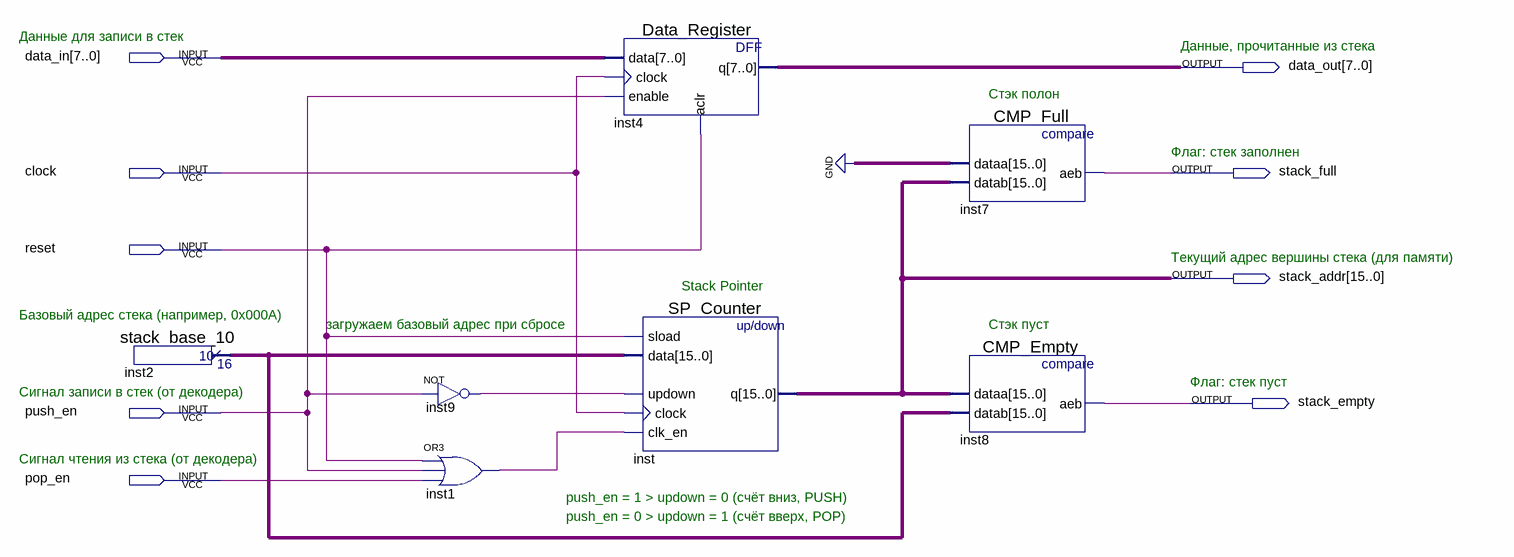
[diagram p0: schematic sheet]
// Quartus schematic stack_control.bdf as structural Verilog: 7 symbols, 9 pins
module stack_control (
  input  [7:0] data_in,
  input  clock,
  input  reset,
  input  push_en,
  input  pop_en,
  output [7:0] data_out,
  output stack_full,
  output [15:0] stack_addr,
  output stack_empty
);

  wire inst1_out, inst9_out;
  wire [15:0] inst2_result;

  stack_base_10 inst2 (.result(inst2_result));
  not inst9 (inst9_out, push_en);
  or inst1 (inst1_out, reset, push_en, pop_en);
  Data_Register inst4 (.data(data_in), .clock(clock), .enable(push_en), .aclr(reset), .q(data_out));
  SP_Counter inst (
    .sload(reset), .data(inst2_result), .updown(inst9_out), .clock(clock), .clk_en(inst1_out), .q(stack_addr));
  CMP_Full inst7 (.dataa({16{1'b0}}), .datab(stack_addr), .aeb(stack_full));
  CMP_Empty inst8 (.dataa(stack_addr), .datab(inst2_result), .aeb(stack_empty));

  // Notes on the sheet:
  //   Данные для записи в стек
  //   Данные, прочитанные из стека
  //   Стэк полон
  //   Флаг: стек заполнен
  //   Текущий адрес вершины стека (для памяти)
  //   Stack Pointer
  //   Базовый адрес стека (например, 0x000A)
  //   загружаем базовый адрес при сбросе
  //   Стэк пуст
  //   Флаг: стек пуст
  //   Сигнал записи в стек (от декодера)
  //   Сигнал чтения из стека (от декодера)
  //   push_en = 1 > updown = 0 (счёт вниз, PUSH)
  //   push_en = 0 > updown = 1 (счёт вверх, POP)
endmodule
